# Altium schematic sheet Alarms.SchDoc: RespiraWorks
size A3; CompanyName: RespiraWorks; DrawnBy: E. Chiu; Organization: Altium; DocumentNumber: 6; Revision: A1; SheetNumber: 6; SheetTotal: 8; PageSetup: Record=PageOptions|CenterHorizontal=True|CenterVertical=True|PrintScale=0.67|XCorrection=1.00|YCorrection=1.00|PrintKind=0|BorderSize=5000000|LeftOffset=0|BottomOffset=0|Orientation=2|PaperLength=1000|PaperWidth=1000|Scale=100|PaperSource=276|PrintQuality=-3|MediaType=1|DitherType=10|PrintScaleMode=1|PaperKind=11"x17" 279.4x431.8mm|PaperIndex=3; ProjectName: FALCON 3S
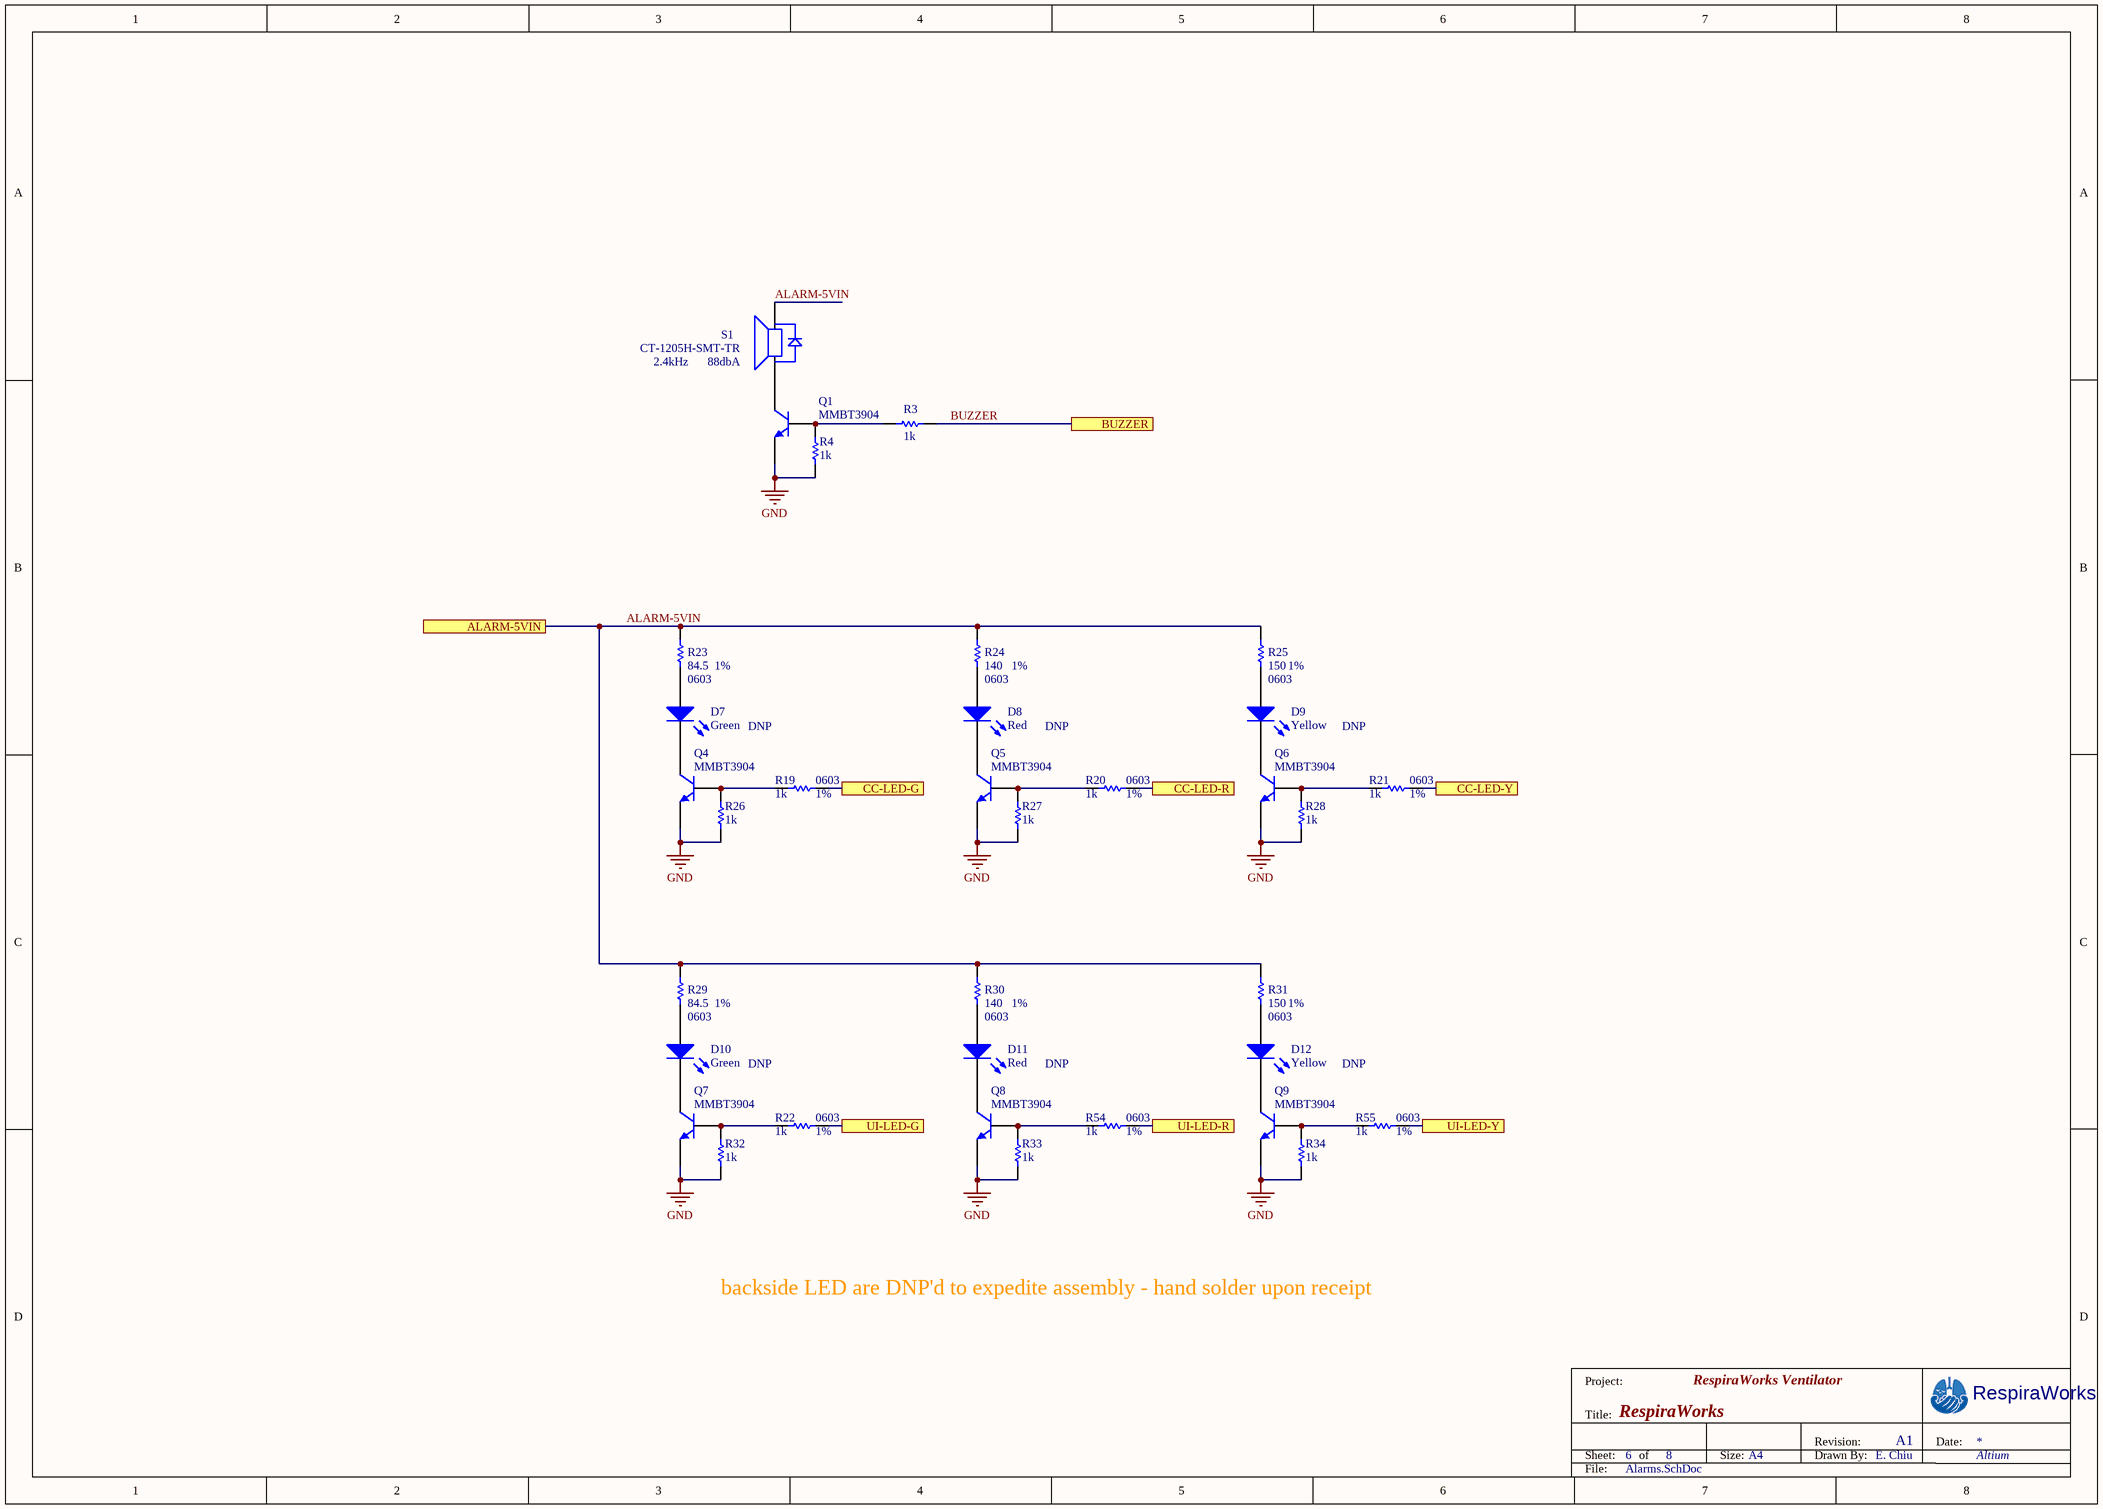
[diagram p0: Alarms.SchDoc]

## Parts
D7  value Green  Do Not Populate: DNP  [2-LED3528]  (hidden comment: LED 3528 GREEN 500MCD)
D8  value Red  Do Not Populate: DNP  [2-LED3528]  (hidden comment: LED 3528 RED 450MCD)
D9  value Yellow  Do Not Populate: DNP  [2-LED3528]  (hidden comment: LED 3528 YELLOW 450MCD)
D10  value Green  Do Not Populate: DNP  [2-LED3528]  (hidden comment: LED 3528 GREEN 500MCD)
D11  value Red  Do Not Populate: DNP  [2-LED3528]  (hidden comment: LED 3528 RED 450MCD)
D12  value Yellow  Do Not Populate: DNP  [2-LED3528]  (hidden comment: LED 3528 YELLOW 450MCD)
Q1  MMBT3904  [3-SOT23]
Q4  MMBT3904  [3-SOT23]
Q5  MMBT3904  [3-SOT23]
Q6  MMBT3904  [3-SOT23]
Q7  MMBT3904  [3-SOT23]
Q8  MMBT3904  [3-SOT23]
Q9  MMBT3904  [3-SOT23]
R3  value 1k  [RES0603]  (hidden comment: RES 0603)
R4  value 1k  [RES0603]  (hidden comment: RES 0603)
R19  value 1k  PCB Package: 0603  Tolerance: 1%  [RES0603]  (hidden comment: RES 0603)
R20  value 1k  PCB Package: 0603  Tolerance: 1%  [RES0603]  (hidden comment: RES 0603)
R21  value 1k  PCB Package: 0603  Tolerance: 1%  [RES0603]  (hidden comment: RES 0603)
R22  value 1k  PCB Package: 0603  Tolerance: 1%  [RES0603]  (hidden comment: RES 0603)
R23  value 84.5  PCB Package: 0603  Tolerance: 1%  [RES0603]  (hidden comment: RES 0603)
R24  value 140  PCB Package: 0603  Tolerance: 1%  [RES0603]  (hidden comment: RES 0603)
R25  value 150  PCB Package: 0603  Tolerance: 1%  [RES0603]  (hidden comment: RES 0603)
R26  value 1k  [RES0603]  (hidden comment: RES 0603)
R27  value 1k  [RES0603]  (hidden comment: RES 0603)
R28  value 1k  [RES0603]  (hidden comment: RES 0603)
R29  value 84.5  PCB Package: 0603  Tolerance: 1%  [RES0603]  (hidden comment: RES 0603)
R30  value 140  PCB Package: 0603  Tolerance: 1%  [RES0603]  (hidden comment: RES 0603)
R31  value 150  PCB Package: 0603  Tolerance: 1%  [RES0603]  (hidden comment: RES 0603)
R32  value 1k  [RES0603]  (hidden comment: RES 0603)
R33  value 1k  [RES0603]  (hidden comment: RES 0603)
R34  value 1k  [RES0603]  (hidden comment: RES 0603)
R54  value 1k  PCB Package: 0603  Tolerance: 1%  [RES0603]  (hidden comment: RES 0603)
R55  value 1k  PCB Package: 0603  Tolerance: 1%  [RES0603]  (hidden comment: RES 0603)
S1  value 88dbA  Frequency: 2.4kHz  [CT-1205H-SMT-TR]  (hidden comment: CT-1205H-SMT-TR)

## Ports
ALARM-5VIN, BUZZER, CC-LED-G, CC-LED-R, CC-LED-Y, UI-LED-G, UI-LED-R, UI-LED-Y

## Nets
GND: Q1.2(E) Q4.2(E) Q5.2(E) Q6.2(E) Q7.2(E) Q8.2(E) Q9.2(E) R4.1 R26.1 R27.1 R28.1 R32.1 R33.1 R34.1
ALARM-5VIN: R23.2 R24.2 R25.2 R29.2 R30.2 R31.2 S1.2 ; port ALARM-5VIN
BUZZER: R3.2 ; port BUZZER
CC-LED-G: R19.1 ; port CC-LED-G
CC-LED-R: R20.1 ; port CC-LED-R
CC-LED-Y: R21.1 ; port CC-LED-Y
UI-LED-G: R22.1 ; port UI-LED-G
UI-LED-R: R54.1 ; port UI-LED-R
UI-LED-Y: R55.1 ; port UI-LED-Y
NetD7_1: D7.1(K) Q4.3(C)
NetD7_2: D7.2(A) R23.1
NetD8_1: D8.1(K) Q5.3(C)
NetD8_2: D8.2(A) R24.1
NetD9_1: D9.1(K) Q6.3(C)
NetD9_2: D9.2(A) R25.1
NetD10_1: D10.1(K) Q7.3(C)
NetD10_2: D10.2(A) R29.1
NetD11_1: D11.1(K) Q8.3(C)
NetD11_2: D11.2(A) R30.1
NetD12_1: D12.1(K) Q9.3(C)
NetD12_2: D12.2(A) R31.1
NetQ1_1: Q1.1(B) R3.1 R4.2
NetQ1_3: Q1.3(C) S1.1
NetQ4_1: Q4.1(B) R19.2 R26.2
NetQ5_1: Q5.1(B) R20.2 R27.2
NetQ6_1: Q6.1(B) R21.2 R28.2
NetQ7_1: Q7.1(B) R22.2 R32.2
NetQ8_1: Q8.1(B) R33.2 R54.2
NetQ9_1: Q9.1(B) R34.2 R55.2

## Notes on the sheet
- backside LED are DNP'd to expedite assembly - hand solder upon receipt
- Project:
- RespiraWorks Ventilator
- Title:
- Sheet:
- of
- Size:
- A4
- Drawn By:
- Revision:
- Date:
- File:

## Library data of the parts
D7 D10 = LED 3528 GREEN 500MCD: Manufacturer P/N: AA3528ZGSK; Manufacturer: Kingbright; Vf: 3.3V; PCB Package: 2-LED3528; Color: Green; Intensity: 500mcd
D8 D11 = LED 3528 RED 450MCD: Manufacturer P/N: AA3528SESK/J3; Manufacturer: Kingbright; Vf: 2.2V; PCB Package: 2-LED3528; Color: Red; Intensity: 450mcd
D9 D12 = LED 3528 YELLOW 450MCD: Manufacturer P/N: AA3528SYCKT/J3; Manufacturer: Kingbright; Color: Green; Vf: 2V; PCB Package: 2-LED3528; Intensity: 450mcd
Q1 Q4-Q9 = MMBT3904: Transistor, BJT NPN, General Purpose 40V; Manufacturer: Fairchild; PCB Package: SOT23; Ic(max): 200mA; Vce(max): 40V; Manufacturer P/N: MMBT3904
R3 R4 R26-R28 R32-R34 = RES 0603: Manufacturer P/N: RC0603FR-071KL; Manufacturer: Yageo; PCB Package: 0603; Tolerance: *; Do Not Populate: *
R19-R22 R54 R55 = RES 0603: Manufacturer P/N: RC0603FR-071KL; Manufacturer: Yageo; Do Not Populate: *
R23 R29 = RES 0603: Manufacturer P/N: RC0603FR-0784R5L; Manufacturer: Yageo; Do Not Populate: *
R24 R30 = RES 0603: Manufacturer P/N: RC0603FR-07140RL; Manufacturer: Yageo; Do Not Populate: *
R25 R31 = RES 0603: Manufacturer P/N: RC0603FR-07150RL; Manufacturer: Yageo; Do Not Populate: *
S1 = CT-1205H-SMT-TR: Buzzers Transducer, Externally Driven Magnetic 5V 60mA 2.4kHz 88dB @ 5V, 10cm Surface Mount Solder Pads; Manufacturer: CUI; Manufacturer P/N: CT-1205H-SMT-TR; PCB Package: CT-1205H-SMT-TR; Tolerance: *; Do Not Populate: *